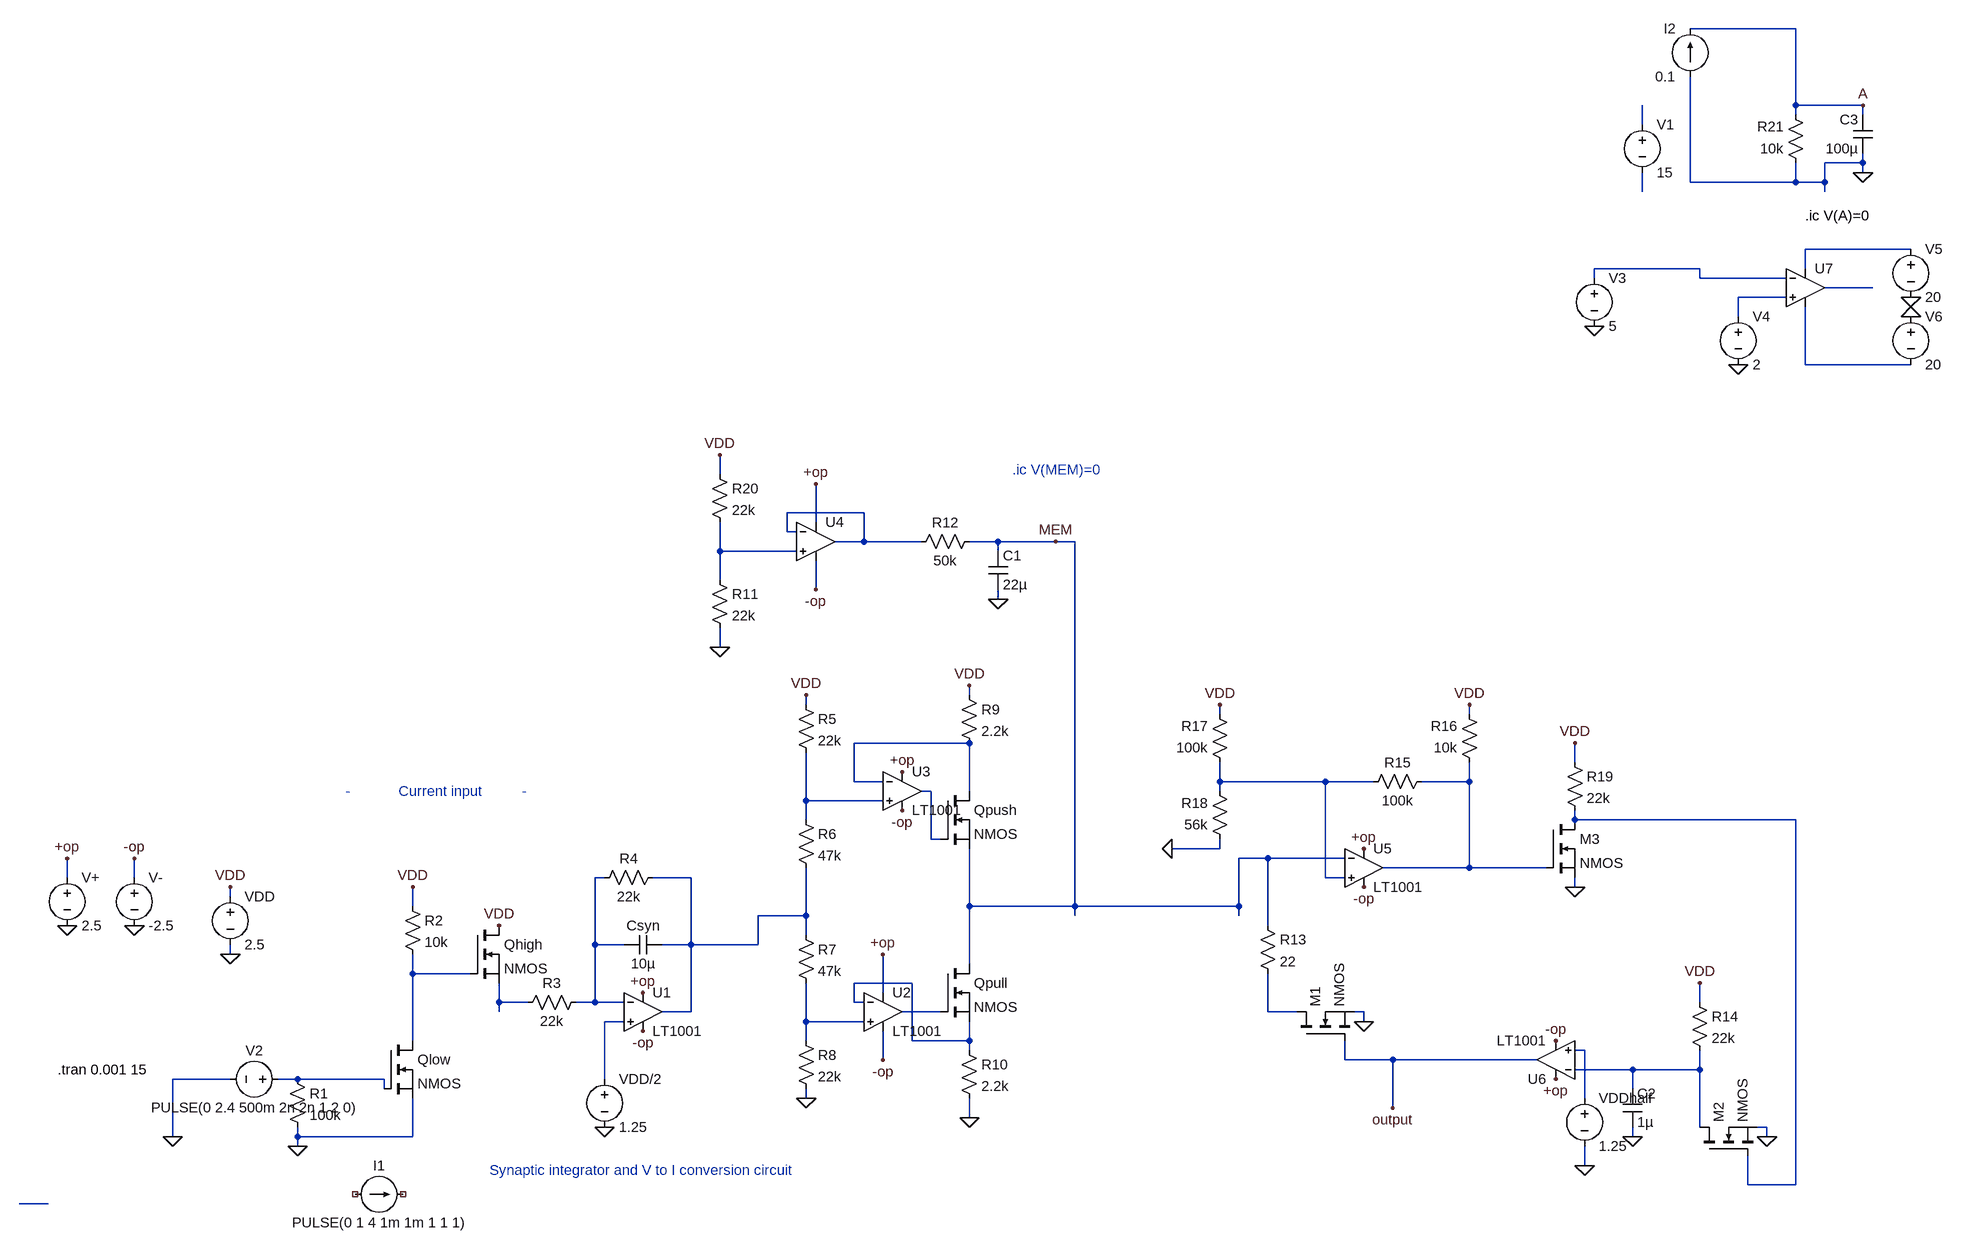
[diagram p0: schematic LIF.asc]
LIF.asc, the LTspice schematic file:
Version 4
SHEET 1 2924 680
WIRE 2672 -2368 2496 -2368
WIRE 2672 -2240 2672 -2368
WIRE 2784 -2240 2672 -2240
WIRE 2672 -2224 2672 -2240
WIRE 2784 -2224 2784 -2240
WIRE 2416 -2208 2416 -2240
WIRE 2784 -2144 2784 -2160
WIRE 2784 -2144 2720 -2144
WIRE 2784 -2128 2784 -2144
WIRE 2496 -2112 2496 -2288
WIRE 2672 -2112 2672 -2144
WIRE 2672 -2112 2496 -2112
WIRE 2720 -2112 2720 -2144
WIRE 2720 -2112 2672 -2112
WIRE 2416 -2096 2416 -2128
WIRE 2720 -2096 2720 -2112
WIRE 2864 -2000 2688 -2000
WIRE 2512 -1968 2336 -1968
WIRE 2688 -1968 2688 -2000
WIRE 2336 -1952 2336 -1968
WIRE 2512 -1952 2512 -1968
WIRE 2656 -1952 2512 -1952
WIRE 2800 -1936 2720 -1936
WIRE 2656 -1920 2576 -1920
WIRE 2576 -1888 2576 -1920
WIRE 2688 -1808 2688 -1904
WIRE 2864 -1808 2688 -1808
WIRE 800 -640 800 -672
WIRE 1040 -576 912 -576
WIRE 960 -560 960 -624
WIRE 912 -544 912 -576
WIRE 928 -544 912 -544
WIRE 1040 -528 1040 -576
WIRE 1040 -528 992 -528
WIRE 1136 -528 1040 -528
WIRE 1264 -528 1216 -528
WIRE 1360 -528 1264 -528
WIRE 1392 -528 1360 -528
WIRE 800 -512 800 -560
WIRE 928 -512 800 -512
WIRE 1264 -512 1264 -528
WIRE 800 -464 800 -512
WIRE 960 -448 960 -496
WIRE 1264 -432 1264 -448
WIRE 800 -352 800 -384
WIRE 1216 -272 1216 -288
WIRE 944 -256 944 -272
WIRE 1712 -240 1712 -256
WIRE 2128 -240 2128 -256
WIRE 1216 -192 1024 -192
WIRE 2304 -160 2304 -192
WIRE 1024 -128 1024 -192
WIRE 1072 -128 1024 -128
WIRE 1712 -128 1712 -160
WIRE 1888 -128 1712 -128
WIRE 1968 -128 1888 -128
WIRE 2128 -128 2128 -160
WIRE 2128 -128 2048 -128
WIRE 1152 -112 1136 -112
WIRE 1216 -112 1216 -192
WIRE 1712 -112 1712 -128
WIRE 944 -96 944 -176
WIRE 1072 -96 944 -96
WIRE 944 -64 944 -96
WIRE 2304 -64 2304 -80
WIRE 2672 -64 2304 -64
WIRE 1152 -32 1152 -112
WIRE 1168 -32 1152 -32
WIRE 1712 -16 1712 -32
WIRE 1712 -16 1632 -16
WIRE 1792 0 1744 0
WIRE 1920 0 1792 0
WIRE 2128 16 2128 -128
WIRE 2128 16 1984 16
WIRE 2256 16 2128 16
WIRE -288 32 -288 0
WIRE -176 32 -176 0
WIRE 608 32 592 32
WIRE 752 32 688 32
WIRE 1888 32 1888 -128
WIRE 1920 32 1888 32
WIRE 2304 48 2304 32
WIRE -16 64 -16 48
WIRE 288 80 288 48
WIRE 1216 80 1216 -16
WIRE 1392 80 1392 -528
WIRE 1392 80 1216 80
WIRE 1744 80 1744 0
WIRE 1744 80 1392 80
WIRE 944 96 944 16
WIRE 944 96 864 96
WIRE 1392 96 1392 80
WIRE 1744 96 1744 80
WIRE 1792 112 1792 0
WIRE 944 128 944 96
WIRE 592 144 592 32
WIRE 640 144 592 144
WIRE 752 144 752 32
WIRE 752 144 704 144
WIRE 864 144 864 96
WIRE 864 144 752 144
WIRE -16 160 -16 144
WIRE 1216 176 1216 80
WIRE 288 192 288 160
WIRE 384 192 288 192
WIRE 1120 208 1024 208
WIRE 1072 224 1072 160
WIRE 432 240 432 208
WIRE 480 240 432 240
WIRE 592 240 592 144
WIRE 592 240 560 240
WIRE 640 240 592 240
WIRE 1024 240 1024 208
WIRE 1040 240 1024 240
WIRE 2512 240 2512 208
WIRE 432 256 432 240
WIRE 752 256 752 144
WIRE 752 256 704 256
WIRE 1168 256 1104 256
WIRE 1792 256 1792 192
WIRE 1840 256 1792 256
WIRE 1952 256 1936 256
WIRE 640 272 608 272
WIRE 944 272 944 208
WIRE 1040 272 944 272
WIRE 1952 272 1952 256
WIRE 288 304 288 192
WIRE 944 304 944 272
WIRE 1120 304 1120 208
WIRE 1216 304 1216 272
WIRE 1216 304 1120 304
WIRE 1216 320 1216 304
WIRE 2320 320 2304 320
WIRE 1072 336 1072 288
WIRE 1920 336 1920 304
WIRE 2000 336 1920 336
WIRE 2240 336 2000 336
WIRE 2400 352 2304 352
WIRE 2512 352 2512 320
WIRE 2512 352 2400 352
WIRE -16 368 -112 368
WIRE 96 368 64 368
WIRE 240 368 96 368
WIRE 608 368 608 272
WIRE 240 384 240 368
WIRE 2400 384 2400 352
WIRE 944 400 944 384
WIRE 2320 400 2320 320
WIRE 2000 416 2000 336
WIRE 1216 432 1216 400
WIRE 2512 448 2512 352
WIRE 2624 448 2608 448
WIRE -112 464 -112 368
WIRE 96 464 96 448
WIRE 288 464 288 400
WIRE 288 464 96 464
WIRE 2400 464 2400 448
WIRE 2624 464 2624 448
WIRE 96 480 96 464
WIRE 2320 512 2320 480
WIRE 2592 544 2592 496
WIRE 2672 544 2672 -64
WIRE 2672 544 2592 544
WIRE -320 576 -368 576
FLAG 96 480 0
FLAG -112 464 0
FLAG -16 160 0
FLAG -16 48 VDD
FLAG 288 48 VDD
FLAG 432 112 VDD
FLAG 608 448 0
FLAG 944 -272 VDD
FLAG 944 400 0
FLAG 672 224 +op
FLAG 1104 -144 +op
FLAG 672 288 -op
FLAG 1104 -80 -op
FLAG -176 112 0
FLAG -288 112 0
FLAG -288 0 +op
FLAG -176 0 -op
FLAG 1216 -288 VDD
FLAG 1216 432 0
FLAG 1072 160 +op
FLAG 1072 336 -op
FLAG 800 -672 VDD
FLAG 800 -352 0
FLAG 960 -624 +op
FLAG 960 -448 -op
FLAG 1264 -432 0
FLAG 1952 272 0
FLAG 2000 416 output
FLAG 2400 464 0
FLAG 2320 512 0
FLAG 2512 208 VDD
FLAG 1952 -16 +op
FLAG 2272 368 +op
FLAG 1952 48 -op
FLAG 2272 304 -op
FLAG 2624 464 0
FLAG 2304 48 0
FLAG 1712 -256 VDD
FLAG 2128 -256 VDD
FLAG 2304 -192 VDD
FLAG 1632 -16 0
FLAG 2784 -2128 0
FLAG 2784 -2240 A
FLAG 2336 -1872 0
FLAG 2576 -1808 0
FLAG 2864 -1888 0
FLAG 2864 -1920 0
FLAG 1360 -528 MEM
SYMBOL res 80 352 R0
SYMATTR InstName R1
SYMATTR Value 100k
SYMBOL current 192 560 R270
WINDOW 0 32 40 VTop 2
WINDOW 3 -32 40 VBottom 2
SYMATTR InstName I1
SYMATTR Value PULSE(0 1 4 1m 1m 1 1 1)
SYMBOL nmos 240 304 R0
SYMATTR InstName Qlow
SYMBOL res 272 64 R0
SYMATTR InstName R2
SYMATTR Value 10k
SYMBOL voltage -16 48 R0
SYMATTR InstName VDD
SYMATTR Value 2.5
SYMBOL nmos 384 112 R0
SYMATTR InstName Qhigh
SYMBOL res 576 224 R90
WINDOW 0 0 56 VBottom 2
WINDOW 3 32 56 VTop 2
SYMATTR InstName R3
SYMATTR Value 22k
SYMBOL voltage 608 352 R0
SYMATTR InstName VDD/2
SYMATTR Value 1.25
SYMBOL Res 704 16 R90
WINDOW 0 0 56 VBottom 2
WINDOW 3 32 56 VTop 2
SYMATTR InstName R4
SYMATTR Value 22k
SYMBOL Cap 704 128 R90
WINDOW 0 0 32 VBottom 2
WINDOW 3 32 32 VTop 2
SYMATTR InstName Csyn
SYMATTR Value 10µ
SYMBOL Res 928 -272 R0
SYMATTR InstName R5
SYMATTR Value 22k
SYMBOL Res 928 -80 R0
SYMATTR InstName R6
SYMATTR Value 47k
SYMBOL Res 928 112 R0
SYMATTR InstName R7
SYMATTR Value 47k
SYMBOL Res 928 288 R0
SYMATTR InstName R8
SYMATTR Value 22k
SYMBOL voltage -288 16 R0
SYMATTR InstName V+
SYMATTR Value 2.5
SYMBOL voltage -176 16 R0
SYMATTR InstName V-
SYMATTR Value -2.5
SYMBOL Res 1200 -288 R0
SYMATTR InstName R9
SYMATTR Value 2.2k
SYMBOL nmos 1168 -112 R0
SYMATTR InstName Qpush
SYMBOL nmos 1168 176 R0
SYMATTR InstName Qpull
SYMBOL Res 1200 304 R0
SYMATTR InstName R10
SYMATTR Value 2.2k
SYMBOL Res 784 -480 R0
SYMATTR InstName R11
SYMATTR Value 22k
SYMBOL OpAmps/UniversalOpAmp 960 -528 R0
SYMATTR InstName U4
SYMBOL res 1232 -544 R90
WINDOW 0 0 56 VBottom 2
WINDOW 3 32 56 VTop 2
SYMATTR InstName R12
SYMATTR Value 50k
SYMBOL Cap 1248 -512 R0
SYMATTR InstName C1
SYMATTR Value 22µ
SYMBOL Res 1776 96 R0
SYMATTR InstName R13
SYMATTR Value 22
SYMBOL nmos 1840 304 R270
SYMATTR InstName M1
SYMBOL Cap 2384 384 R0
SYMATTR InstName C2
SYMATTR Value 1µ
SYMBOL voltage 2320 384 R0
SYMATTR InstName VDDhalf
SYMATTR Value 1.25
SYMBOL Res 2496 224 R0
SYMATTR InstName R14
SYMATTR Value 22k
SYMBOL nmos 2512 496 R270
SYMATTR InstName M2
SYMBOL Res 2064 -144 R90
WINDOW 0 0 56 VBottom 2
WINDOW 3 32 56 VTop 2
SYMATTR InstName R15
SYMATTR Value 100k
SYMBOL Res 2144 -144 R180
WINDOW 0 36 76 Left 2
WINDOW 3 36 40 Left 2
SYMATTR InstName R16
SYMATTR Value 10k
SYMBOL Res 1728 -144 R180
WINDOW 0 36 76 Left 2
WINDOW 3 36 40 Left 2
SYMATTR InstName R17
SYMATTR Value 100k
SYMBOL Res 1728 -16 R180
WINDOW 0 36 76 Left 2
WINDOW 3 36 40 Left 2
SYMATTR InstName R18
SYMATTR Value 56k
SYMBOL nmos 2256 -64 R0
SYMATTR InstName M3
SYMBOL Res 2288 -176 R0
SYMATTR InstName R19
SYMATTR Value 22k
SYMBOL Res 2688 -2128 R180
WINDOW 0 36 76 Left 2
WINDOW 3 36 40 Left 2
SYMATTR InstName R21
SYMATTR Value 10k
SYMBOL Cap 2800 -2160 R180
WINDOW 0 24 56 Left 2
WINDOW 3 24 8 Left 2
SYMATTR InstName C3
SYMATTR Value 100µ
SYMBOL current 2496 -2288 R180
WINDOW 0 24 80 Left 2
WINDOW 3 24 0 Left 2
SYMATTR InstName I2
SYMATTR Value 0.1
SYMBOL voltage 2416 -2224 R0
SYMATTR InstName V1
SYMATTR Value 15
SYMBOL voltage 80 368 R90
WINDOW 0 -32 56 VBottom 2
WINDOW 3 32 56 VTop 2
SYMATTR InstName V2
SYMATTR Value PULSE(0 2.4 500m 2n 2n 1 2 0)
SYMBOL Res 784 -656 R0
SYMATTR InstName R20
SYMATTR Value 22k
SYMBOL Voltage 2336 -1968 R0
SYMATTR InstName V3
SYMATTR Value 5
SYMBOL Voltage 2576 -1904 R0
SYMATTR InstName V4
SYMATTR Value 2
SYMBOL Voltage 2864 -2016 R0
SYMATTR InstName V5
SYMATTR Value 20
SYMBOL Voltage 2864 -1904 R0
SYMATTR InstName V6
SYMATTR Value 20
SYMBOL OpAmps/LT1001 1952 -48 R0
SYMATTR InstName U5
SYMBOL OpAmps/LT1001 2272 400 R180
SYMATTR InstName U6
SYMBOL OpAmps/LT1001 1072 192 R0
SYMATTR InstName U2
SYMBOL OpAmps/LT1001 1104 -176 R0
SYMATTR InstName U3
SYMBOL OpAmps/LT1001 672 192 R0
SYMATTR InstName U1
SYMBOL OpAmps/UniversalOpAmp 2688 -1936 R0
SYMATTR InstName U7
TEXT -304 352 Left 2 !.tran 0.001 15
TEXT 176 -112 Left 2 ;-            Current input          -
TEXT 416 520 Left 2 ;Synaptic integrator and V to I conversion circuit
TEXT 2688 -2056 Left 2 !.ic V(A)=0
TEXT 1288 -648 Left 2 ;.ic V(MEM)=0

The netlist it stands for:
* LIF.asc
R1 N027 0 100k
I1 NC_01 NC_02 PULSE(0 1 4 1m 1m 1 1 1)
M§Qlow N018 N027 0 0 NMOS
R2 VDD N018 10k
VDD VDD 0 2.5
M§Qhigh VDD N018 N020 N020 NMOS
R3 N016 N020 22k
VDD/2 N023 0 1.25
R4 N017 N016 22k
Csyn N017 N016 10µ
R5 VDD N014 22k
R6 N014 N017 47k
R7 N017 N024 47k
R8 N024 0 22k
V+ +op 0 2.5
V- -op 0 -2.5
R9 VDD N010 2.2k
M§Qpush N010 N013 MEM MEM NMOS
M§Qpull MEM N021 N019 N019 NMOS
R10 N019 0 2.2k
R11 N009 0 22k
XU4 N009 N008 +op -op N008 level1 Avol=1Meg GBW=10Meg Vos=0 En=0 Enk=0 In=0 Ink=0 Rin=500Meg  ; pins In+ In- V+ V- OUT
R12 MEM N008 50k
C1 MEM 0 22µ
R13 MEM N022 22
M1 N022 output 0 0 NMOS
C2 N026 0 1µ
VDDhalf N025 0 1.25
R14 VDD N026 22k
M2 N026 N015 0 0 NMOS
R15 N012 N011 100k
R16 N012 VDD 10k
R17 N011 VDD 100k
R18 0 N011 56k
M3 N015 N012 0 0 NMOS
R19 VDD N015 22k
R21 0 A 10k
C3 0 A 100µ
I2 0 A 0.1
V1 N001 N002 15
V2 N027 0 PULSE(0 2.4 500m 2n 2n 1 2 0)
R20 VDD N009 22k
V3 N004 0 5
V4 N006 0 2
V5 N003 0 20
V6 0 N007 20
XU5 N011 MEM +op -op N012 LT1001  ; pins In+ In- V+ V- OUT
XU6 N025 N026 +op -op output LT1001  ; pins In+ In- V+ V- OUT
XU2 N024 N019 +op -op N021 LT1001  ; pins In+ In- V+ V- OUT
XU3 N014 N010 +op -op N013 LT1001  ; pins In+ In- V+ V- OUT
XU1 N023 N016 +op -op N017 LT1001  ; pins In+ In- V+ V- OUT
XU7 N006 N004 N003 N007 N005 level1 Avol=1Meg GBW=10Meg Vos=0 En=0 Enk=0 In=0 Ink=0 Rin=500Meg  ; pins In+ In- V+ V- OUT
.model NMOS NMOS
.model PMOS PMOS
.lib standard.mos
.tran 0.001 15
* -            Current input          -
* Synaptic integrator and V to I conversion circuit
.ic V(A)=0
* .ic V(MEM)=0
.lib UniversalOpAmp1.lib
.lib LTC.lib
.backanno
.end